# EAGLE design upduino_v2.1_release (EAGLE 8.6.3)

## Sheet 1 of 3
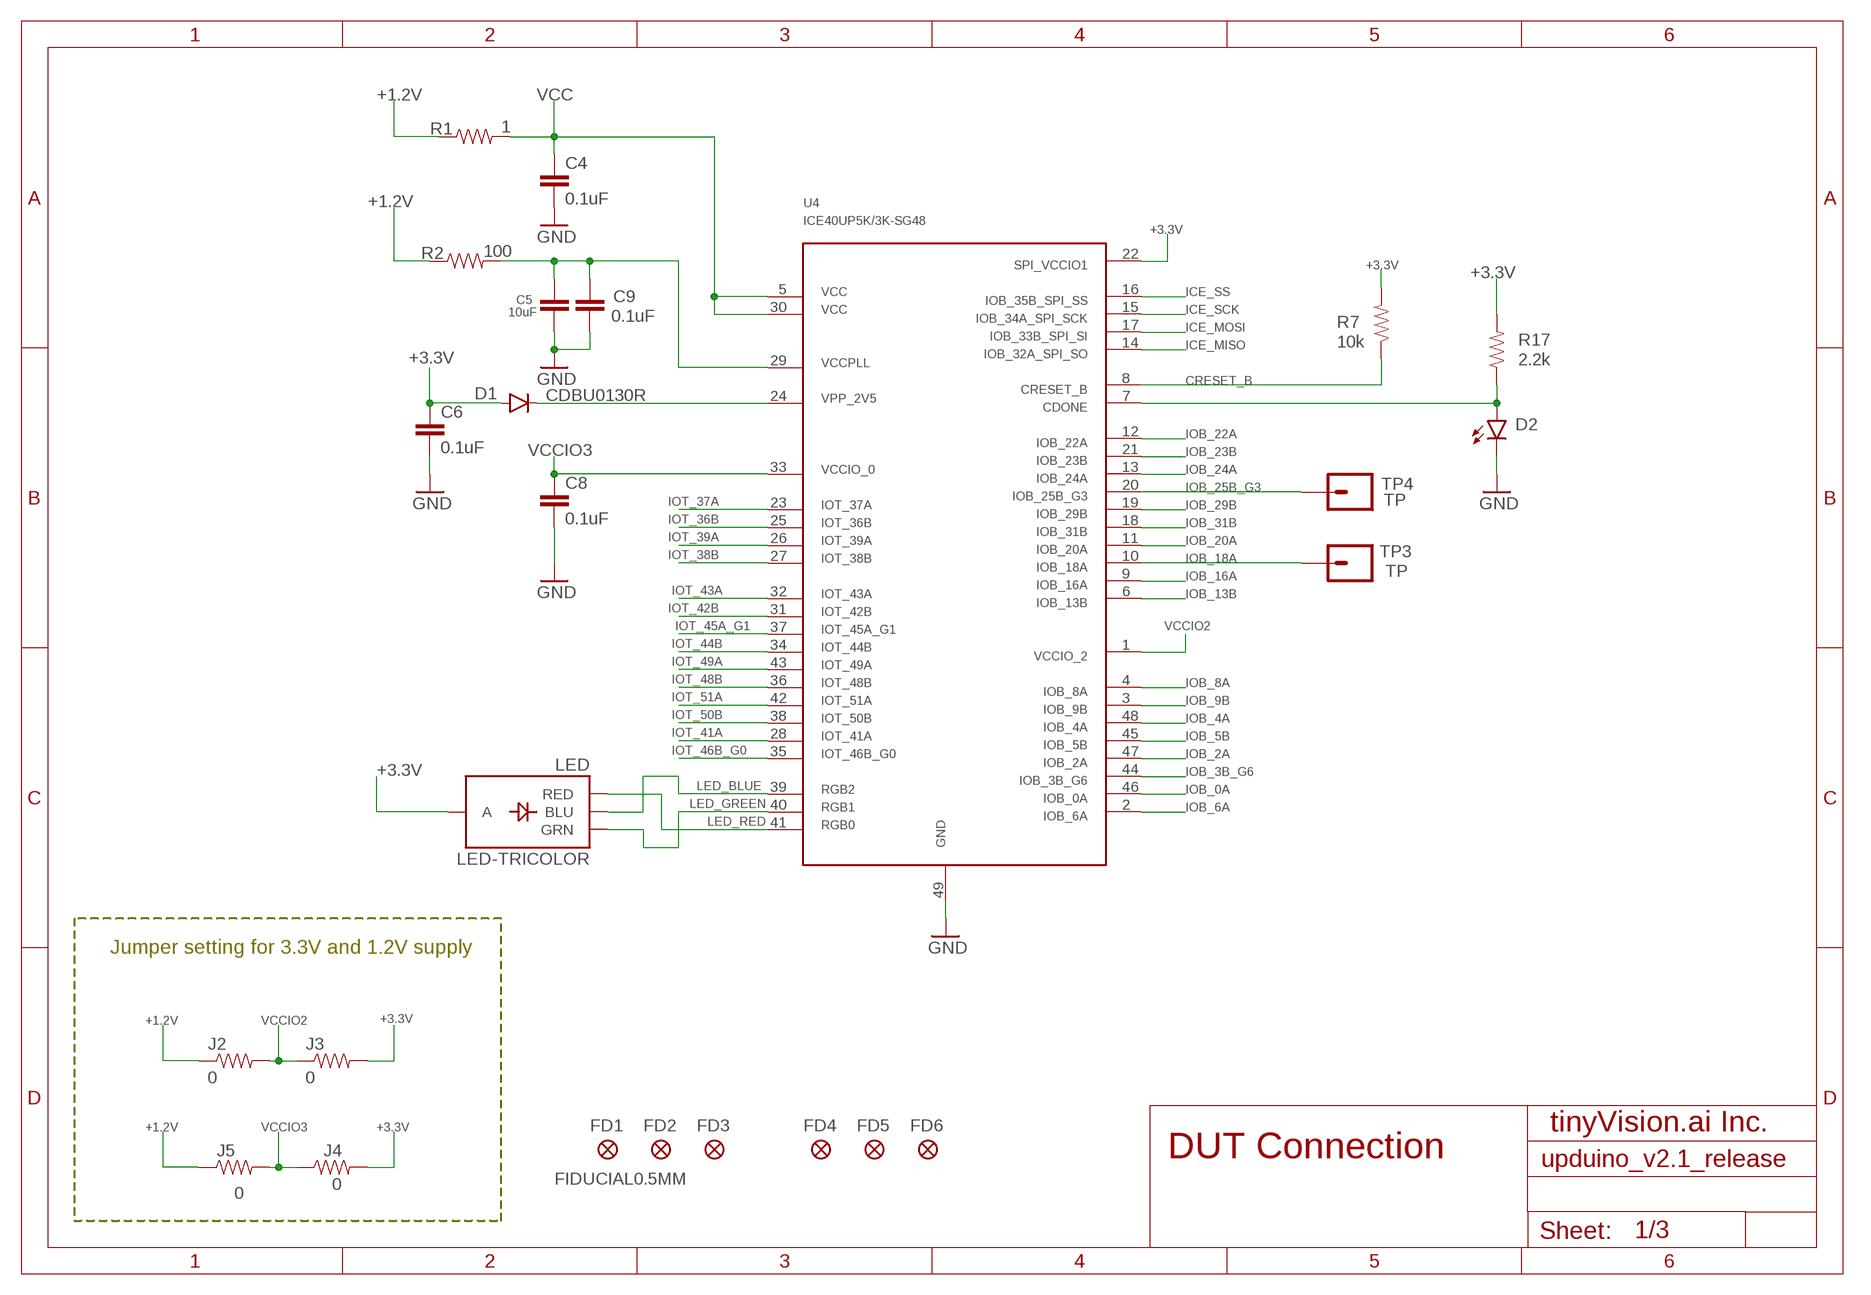
[diagram p0: schematic, sheet 1]

### Parts
C4  0.1uF  CAP0603-CAP  [0603-CAP]
C5  10uF  CAP0603-CAP  [0603-CAP]
C6  0.1uF  CAP0603-CAP  [0603-CAP]
C8  0.1uF  CAP0603-CAP  [0603-CAP]
C9  0.1uF  CAP0603-CAP  [0603-CAP]
D1  CDBU0130R  DIODE1  [SOD523]
D2  LED0603  [LED-0603]
FD1  FIDUCIAL0.5MM  [FIDUCIAL_0.5MM]
FD2  FIDUCIAL0.5MM  [FIDUCIAL_0.5MM]
FD3  FIDUCIAL0.5MM  [FIDUCIAL_0.5MM]
FD4  FIDUCIAL0.5MM  [FIDUCIAL_0.5MM]
FD5  FIDUCIAL0.5MM  [FIDUCIAL_0.5MM]
FD6  FIDUCIAL0.5MM  [FIDUCIAL_0.5MM]
J2  0  RESISTOR0603-RES  [0603-RES]
J3  0  RESISTOR0603-RES  [0603-RES]
J4  0  RESISTOR0603-RES  [0603-RES]
J5  0  RESISTOR0603-RES  [0603-RES]
LED  LED-TRICOLOR  [LED-TRICOLOR-SMD]
R1  1  RESISTOR0603-RES  [0603-RES]
R2  100  RESISTOR0603-RES  [0603-RES]
R7  10k  RESISTOR0603-RES  [0603-RES]
R17  2.2k  RESISTOR0603-RES  [0603-RES]
TP3  TP  [TP]
TP4  TP  [TP]
U4  ICE40UP5K/3K-SG48  [ICE40UP5K/3K-SG48]

### Nets
+1.2V: J2.1 J5.1 R1.1 R2.1 ; also sheet 2
+3.3V: C6.1 D1.A J3.2 J4.2 LED.A R7.2 R17.2 U4.22 ; also sheet 2
CRESET_B: R7.1 U4.8 ; also sheet 3
GND: C4.2 C5.2 C6.2 C8.2 C9.2 D2.C U4.49 ; also sheet 2,3
ICE_MISO: U4.14 ; also sheet 2
ICE_MOSI: U4.17 ; also sheet 2
ICE_SCK: U4.15 ; also sheet 2,3
ICE_SS: U4.16 ; also sheet 2,3
IOB_0A: U4.46 ; also sheet 2
IOB_2A: U4.47 ; also sheet 2
IOB_3B_G6: U4.44 ; also sheet 2
IOB_4A: U4.48 ; also sheet 2
IOB_5B: U4.45 ; also sheet 2
IOB_6A: U4.2 ; also sheet 2
IOB_8A: U4.4 ; also sheet 2
IOB_9B: U4.3 ; also sheet 2
IOB_13B: U4.6 ; also sheet 2
IOB_16A: U4.9 ; also sheet 2
IOB_18A: TP3.1 U4.10
IOB_20A: U4.11 ; also sheet 2
IOB_22A: U4.12 ; also sheet 2
IOB_23B: U4.21 ; also sheet 2
IOB_24A: U4.13 ; also sheet 2
IOB_25B_G3: TP4.1 U4.20
IOB_29B: U4.19 ; also sheet 2
IOB_31B: U4.18 ; also sheet 2
IOT_36B: U4.25 ; also sheet 2
IOT_37A: U4.23 ; also sheet 2
IOT_38B: U4.27 ; also sheet 2
IOT_39A: U4.26 ; also sheet 2
IOT_41A: U4.28 ; also sheet 2
IOT_42B: U4.31 ; also sheet 2
IOT_43A: U4.32 ; also sheet 2
IOT_44B: U4.34 ; also sheet 2
IOT_45A_G1: U4.37 ; also sheet 2
IOT_46B_G0: U4.35 ; also sheet 2
IOT_48B: U4.36 ; also sheet 2
IOT_49A: U4.43 ; also sheet 2
IOT_50B: U4.38 ; also sheet 2
IOT_51A: U4.42 ; also sheet 2
LED_BLUE: LED.B(BLU) U4.39
LED_GREEN: LED.G(GRN) U4.40
LED_RED: LED.R(RED) U4.41
N$1: C5.1 C9.1 R2.2 U4.29
N$3: D1.C U4.24
N$16: D2.A R17.1 U4.7
VCC: C4.1 R1.2 U4.5 U4.30
VCCIO2: J2.2 J3.1 U4.1
VCCIO3: C8.1 J4.1 J5.2 U4.33

### Notes on the sheet
- Jumper setting for 3.3V and 1.2V supply
- tinyVision.ai Inc.
- DUT Connection

## Sheet 2 of 3
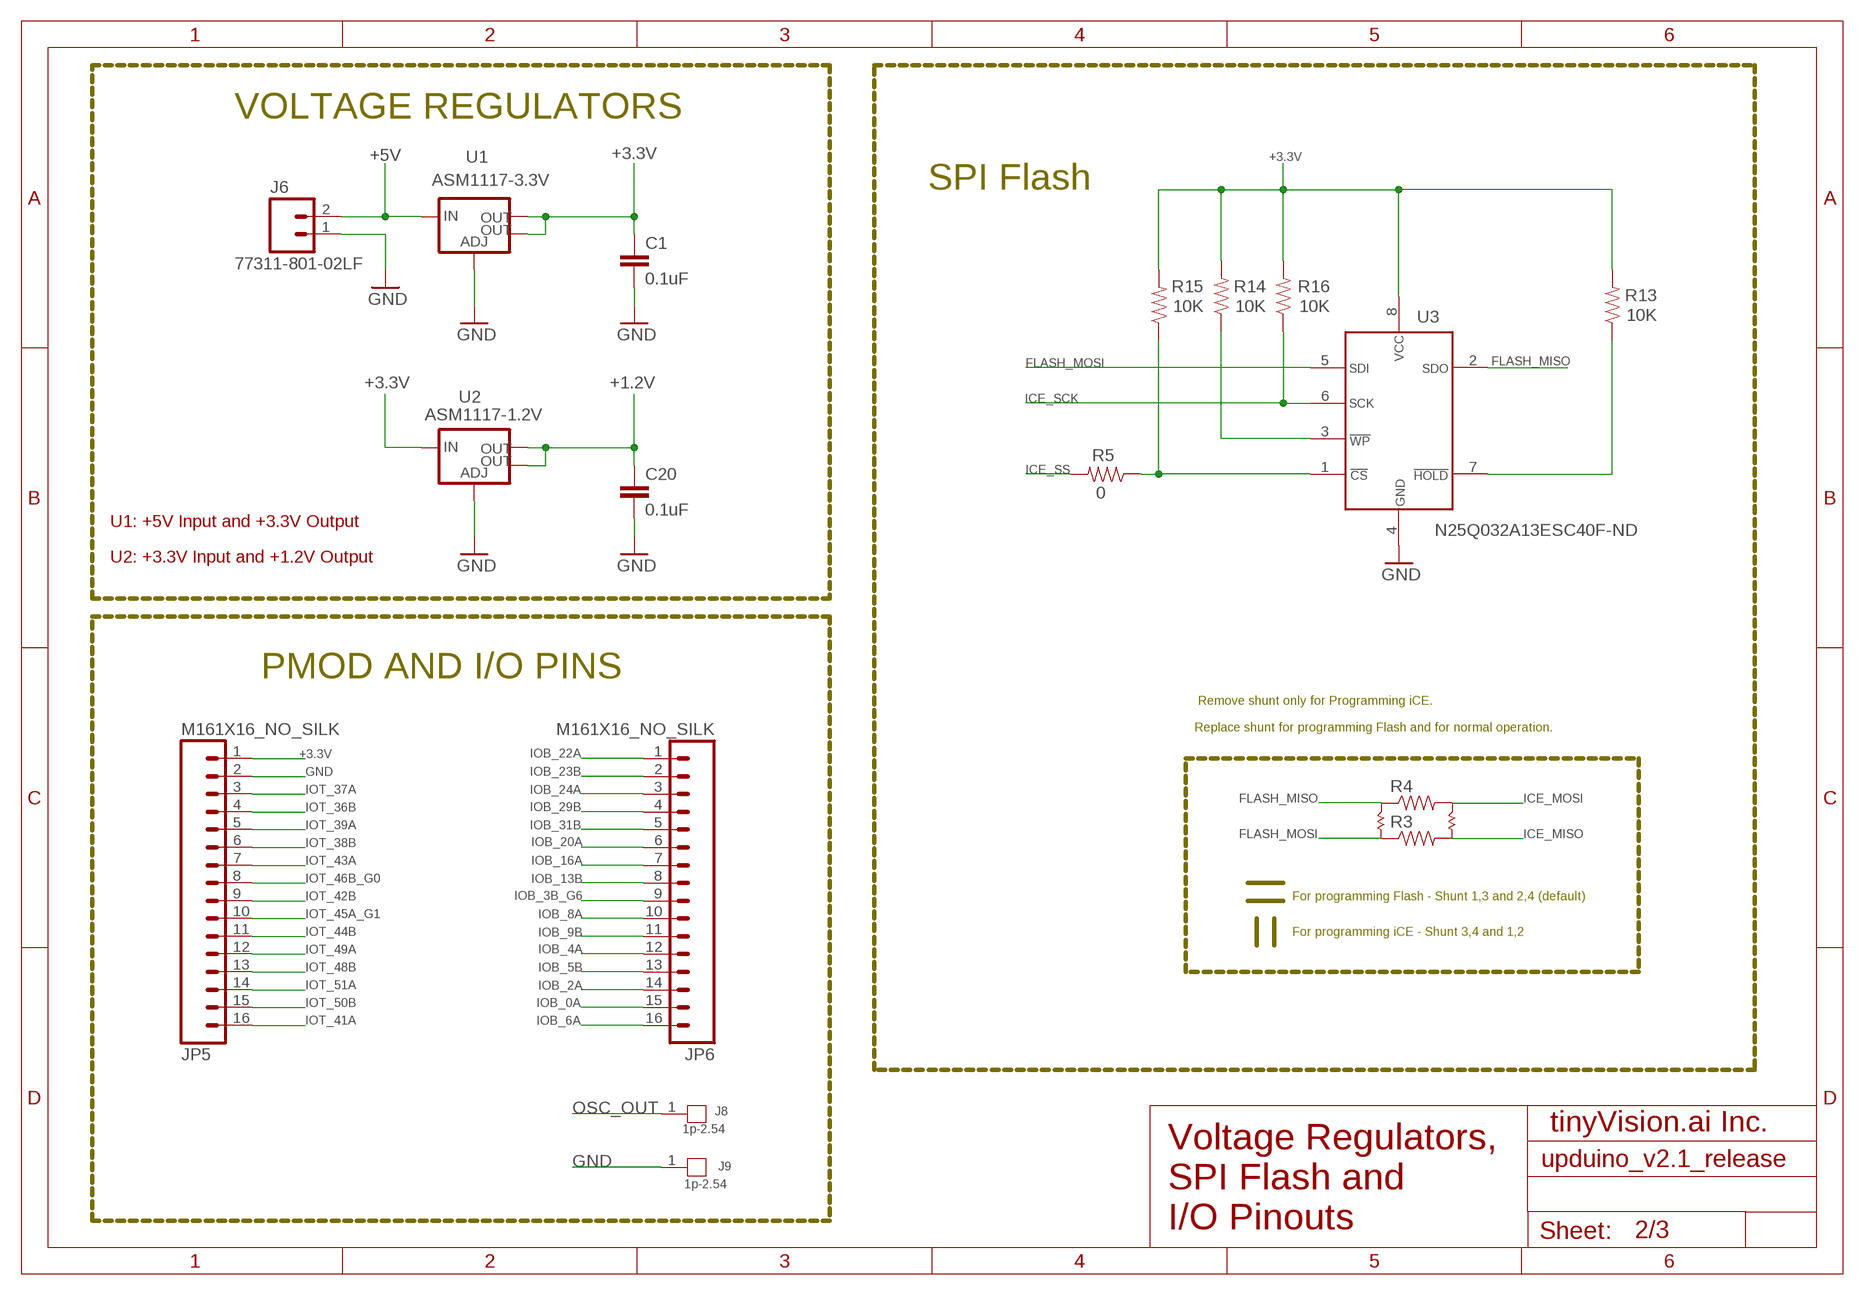
[diagram p1: schematic, sheet 2]

### Parts
C1  0.1uF  CAP0603-CAP  [0603-CAP]
C20  0.1uF  CAP0603-CAP  [0603-CAP]
J6  77311-801-02LF  M02PTH  [1X02]
J8  1p-2.54  DIP-BLACK-ROUND-FEMALE-HEADER-VERT(1P-2.54)  [1P-65/35MIL]
J9  1p-2.54  DIP-BLACK-ROUND-FEMALE-HEADER-VERT(1P-2.54)  [1P-65/35MIL]
JP5  M161X16_NO_SILK  [1X16_NO_SILK]
JP6  M161X16_NO_SILK  [1X16_NO_SILK]
R3  RESISTOR0603  [0603-RES]
R4  RESISTOR0603  [0603-RES]
R5  0  RESISTOR0603  [0603-RES]
R13  10K  RESISTOR0603-RES  [0603-RES]
R14  10K  RESISTOR0603-RES  [0603-RES]
R15  10K  RESISTOR0603-RES  [0603-RES]
R16  10K  RESISTOR0603-RES  [0603-RES]
U1  ASM1117-3.3V  V_REG_LM1117SOT223  [SOT223]
U2  ASM1117-1.2V  V_REG_LM1117SOT223  [SOT223]
U3  N25Q032A13ESC40F-ND  [SO8]

### Nets
+1.2V: C20.1 U2.2(OUT) U2.4(OUT) ; also sheet 1
+3.3V: C1.1 JP5.1 R13.2 R14.2 R15.2 R16.2 U1.2(OUT) U1.4(OUT) U2.3(IN) U3.8 ; also sheet 1
+5V: J6.2 U1.3(IN) ; also sheet 3
FLASH_MISO: R4.1 U3.2 ; also sheet 3
FLASH_MOSI: R3.1 U3.5 ; also sheet 3
GND: C1.2 C20.2 J6.1 J9.1 JP5.2 U1.1(ADJ) U2.1(ADJ) U3.4 ; also sheet 1,3
ICE_MISO: R3.2 ; also sheet 1
ICE_MOSI: R4.2 ; also sheet 1
ICE_SCK: R16.1 U3.6 ; also sheet 1,3
ICE_SS: R5.2 ; also sheet 1,3
IOB_0A: JP6.15 ; also sheet 1
IOB_2A: JP6.14 ; also sheet 1
IOB_3B_G6: JP6.9 ; also sheet 1
IOB_4A: JP6.12 ; also sheet 1
IOB_5B: JP6.13 ; also sheet 1
IOB_6A: JP6.16 ; also sheet 1
IOB_8A: JP6.10 ; also sheet 1
IOB_9B: JP6.11 ; also sheet 1
IOB_13B: JP6.8 ; also sheet 1
IOB_16A: JP6.7 ; also sheet 1
IOB_20A: JP6.6 ; also sheet 1
IOB_22A: JP6.1 ; also sheet 1
IOB_23B: JP6.2 ; also sheet 1
IOB_24A: JP6.3 ; also sheet 1
IOB_29B: JP6.4 ; also sheet 1
IOB_31B: JP6.5 ; also sheet 1
IOT_36B: JP5.4 ; also sheet 1
IOT_37A: JP5.3 ; also sheet 1
IOT_38B: JP5.6 ; also sheet 1
IOT_39A: JP5.5 ; also sheet 1
IOT_41A: JP5.16 ; also sheet 1
IOT_42B: JP5.9 ; also sheet 1
IOT_43A: JP5.7 ; also sheet 1
IOT_44B: JP5.11 ; also sheet 1
IOT_45A_G1: JP5.10 ; also sheet 1
IOT_46B_G0: JP5.8 ; also sheet 1
IOT_48B: JP5.13 ; also sheet 1
IOT_49A: JP5.12 ; also sheet 1
IOT_50B: JP5.15 ; also sheet 1
IOT_51A: JP5.14 ; also sheet 1
N$4: R13.1 U3.7
N$6: R14.1 U3.3
N$7: R5.1 R15.1 U3.1
OSC_OUT: J8.1 ; also sheet 3

### Notes on the sheet
- VOLTAGE REGULATORS
- SPI Flash
- U3
- U1: +5V Input and +3.3V Output
- U2: +3.3V Input and +1.2V Output
- PMOD AND I/O PINS
- Remove shunt only for Programming iCE.
- Replace shunt for programming Flash and for normal operation.
- For programming Flash - Shunt 1,3 and 2,4 (default)
- For programming iCE - Shunt 3,4 and 1,2
- tinyVision.ai Inc.
- Voltage Regulators, 
  SPI Flash and 
  I/O Pinouts

## Sheet 3 of 3
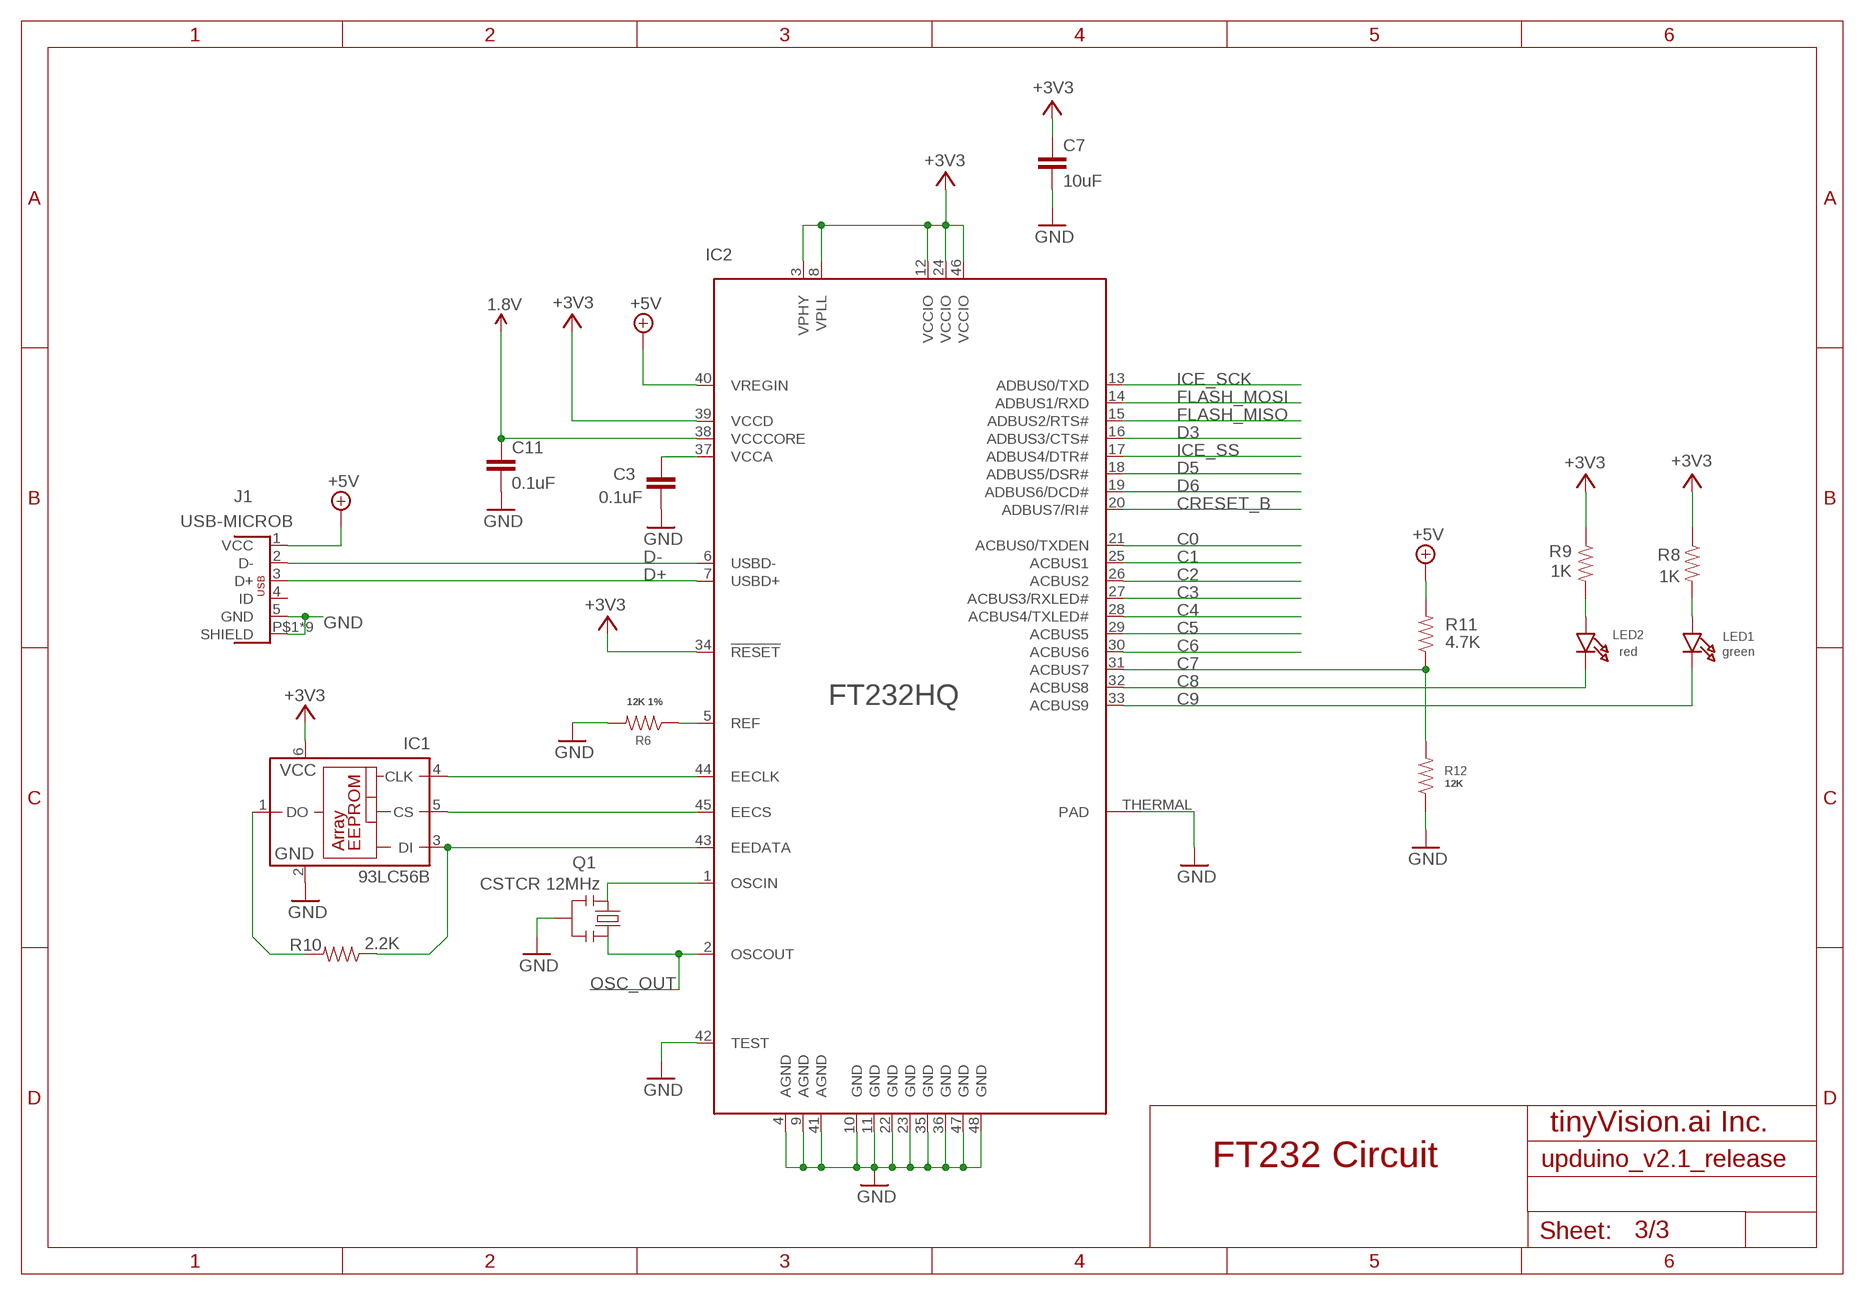
[diagram p2: schematic, sheet 3]

### Parts
C3  0.1uF  CAP0603-CAP  [0603-CAP]
C7  10uF  CAP0603-CAP  [0603-CAP]
C11  0.1uF  CAP0603-CAP  [0603-CAP]
IC1  93LC56B  93LC76A  [SOT23-6]
IC2  FT232HQ  [QFN48_8MM]
J1  USB-MICROB  [USB_MICROB_10118194-0001LF]
LED1  green  LED0805_NOOUTLINE  [CHIPLED_0805_NOOUTLINE]
LED2  red  LED0805_NOOUTLINE  [CHIPLED_0805_NOOUTLINE]
Q1  CSTCR 12MHz  RESONATORSMD  [RESONATOR-SMD]
R6  12K 1%  RESISTOR0603  [0603-RES]
R8  1K  RESISTOR0603  [0603-RES]
R9  1K  RESISTOR0603  [0603-RES]
R10  2.2K  RESISTOR0603  [0603-RES]
R11  4.7K  RESISTOR0603  [0603-RES]
R12  12K  RESISTOR0603  [0603-RES]

### Nets
1.8V: C11.1 IC2.38(VCCCORE)
+3V3: C7.1 IC1.6(VCC) IC2.3(VPHY) IC2.8(VPLL) IC2.12(VCCIO) IC2.24(VCCIO) IC2.34(!RESET) IC2.39(VCCD) IC2.46(VCCIO) R8.1 R9.1
+5V: IC2.40(VREGIN) J1.1(VCC) R11.2 ; also sheet 2
C0: IC2.21(ACBUS0/TXDEN)
C1: IC2.25(ACBUS1)
C2: IC2.26(ACBUS2)
C3: IC2.27(ACBUS3/RXLED#)
C4: IC2.28(ACBUS4/TXLED#)
C5: IC2.29(ACBUS5)
C6: IC2.30(ACBUS6)
C7: IC2.31(ACBUS7) R11.1 R12.2
C8: IC2.32(ACBUS8) LED2.C
C9: IC2.33(ACBUS9) LED1.C
CRESET_B: IC2.20(ADBUS7/RI#) ; also sheet 1
D3: IC2.16(ADBUS3/CTS#)
D5: IC2.18(ADBUS5/DSR#)
D6: IC2.19(ADBUS6/DCD#)
D+: IC2.7(USBD+) J1.3(D+)
D-: IC2.6(USBD-) J1.2(D-)
FLASH_MISO: IC2.15(ADBUS2/RTS#) ; also sheet 2
FLASH_MOSI: IC2.14(ADBUS1/RXD) ; also sheet 2
GND: C3.2 C7.2 C11.2 IC1.2(GND) IC2.4(AGND) IC2.9(AGND) IC2.10(GND) IC2.11(GND) IC2.22(GND) IC2.23(GND) IC2.35(GND) IC2.36(GND) IC2.41(AGND) IC2.42(TEST) IC2.47(GND) IC2.48(GND) IC2.THERMAL(PAD) J1.5(GND) J1.P$1(SHIELD) J1.P$2(SHIELD) J1.P$3(SHIELD) J1.P$4(SHIELD) J1.P$5(SHIELD) J1.P@1(SHIELD) J1.P@2(SHIELD) J1.P@3(SHIELD) J1.P@4(SHIELD) Q1.2 R6.2 R12.1 ; also sheet 1,2
ICE_SCK: IC2.13(ADBUS0/TXD) ; also sheet 1,2
ICE_SS: IC2.17(ADBUS4/DTR#) ; also sheet 1,2
N$2: IC2.1(OSCIN) Q1.1
N$9: IC2.5(REF) R6.1
N$10: LED2.A R9.2
N$11: LED1.A R8.2
N$12: IC1.3(DI) IC2.43(EEDATA) R10.1
N$13: IC1.5(CS) IC2.45(EECS)
N$14: IC1.4(CLK) IC2.44(EECLK)
N$15: IC1.1(DO) R10.2
OSC_OUT: IC2.2(OSCOUT) Q1.3 ; also sheet 2
VCCA: C3.1 IC2.37(VCCA)
Unconnected: J1.4(ID)

### Notes on the sheet
- tinyVision.ai Inc.
- FT232 Circuit

## Library data of the parts
C1 C3-C9 C11 C20 = gtjennings_pcb_121217_1200_release:CAP: Capacitor Standard 0603 ceramic capacitor, and 0.1" leaded capacitor.
D1 = CDBU0130R:DIODE1
D2 = SparkFun-LED:LED: LED (Generic) Standard schematic elements and footprints for 5mm, 3mm, 1206, and 0603 sized LEDs. Generic LEDs with no color specified.
FD1-FD6 = VS_Misc:FIDUCIAL0.5MM
IC1 = microchip:93*76?: 8K Microwire Compatible Serial EEPROM Source: http://ww1.microchip.com/downloads/en/DeviceDoc/21796H.pdf; MF: MICROCHIP; MPN: 93LC76AT-I/OT; OC_FARNELL: 1556170; OC_NEWARK: 61H6824
IC2 = gtjennings_pcb_121217_1200_release:FT232H
J1 = VS_Connectors:USB-MICROB: CONN RCPT STD MICRO USB TYPE AB
J2-J5 R1 R2 R7 R13-R17 = SparkFun-Resistors:RESISTOR: Resistor Basic schematic elements and footprints for 0603, 1206, and PTH resistors.
J6 = SparkFun-Connectors:M02: Standard 2-pin 0.1" header. Use with - straight break away headers ( PRT-00116) - right angle break away headers (PRT-00553) - swiss pins (PRT-00743) - machine pins (PRT-00117) - female headers (PRT-00115) Molex polarized connector foot print use with: PRT-08233 with associated crimp pins and housings. 2.54_SCREWTERM for use with PRT-10571. 3.5mm Screw Terminal footprints for PRT-08084 5mm Screw Terminal footprints for use with PRT-08432
J8 J9 = Seeed-OPL-Connector:DIP-BLACK-ROUND-FEMALE-HEADER-VERT(1P-2.54): 320030026; MPN: RF130-1013BBS0741
JP5 JP6 = SparkFun-Connectors:M16: 1x16 .1" header
LED = SparkFun-LED:LED-TRICOLOR: Tri-Color LED SMD Proven layout and schematic for triple color LED in SMD package - common anode. Spark Fun Electronics SKU : COM-07844
LED1 LED2 = microbuilder:LED: LED 0603 - 0603 Surface Mount Package 2mA: Green LED - Low Power (3.9mcd, 2ma, 1.7Vf) - Digikey: 475-2709-2-ND Orange LED - Low Power (9.8mcd, 2ma, 1.8Vf) - Digikey: 475-1194-2-ND Red LED - Low Power (5mcd, 2ma, 1.8Vf) - Digikey: 475-1195-2-ND Yellow LED - Low Power (7mcd, 2ma, 1.8Vf) - Digikey: 475-1196-2-ND 5mA: Blue LED - Low Power (17mcd, 5ma, 2.9Vf) - Digikey: LNJ937W8CRACT-ND 0805 - 0805 Surface Mount Package 2mA: Red LED (8.8mcd, 2mA, 1.8Vf, Clear) - Low Power [Digikey: 475-2510-1-ND] Green LED (5mcd, 2mA, 1.8Vf, Clear) - Low Power [Digikey: 475-2730-1-ND] Yellow LED (11.3mcd, 2mA, 1.8Vf, Clear) - Low Power [Digikey: 475-2555-1-ND] 20mA: Red LED (104mcd, 20mA, Diffused) - LS R976 [Digikey: 475-1278-6-ND] Red LED (12mcd, 20mA, 2.0Vf, Clear) - APT2012EC [Digikey: 754-1128-1-ND] Green LED (15mcd, 20mA, 2.2Vf, Clear) - APT2012GC [Digikey: 754-1131-1-ND] Orange LED (160mcd, 20mA, 2.1Vf, Clear) - APT2012SECK [Digikey: 754-1130-1-ND] 1206 - 1206 Surface Mount Package Green LED (26mcd, 20mA, Diffused) - LG N971 [Digikey: 475-1407-6-ND] Red LED (15mcd, 20mA, Diffused) - LH N974 [Digikey: 475-1416-6-ND] Cree - Cree High-Power Surface Mount LEDs XPEBWT-L1-0000-00D50 - White 111lm 350mA 2.9Vf 6200K 110° XTEAWT-00-0000-00000LEE3 - White 114lm 350mA 2.85Vf 5000K 115° Everlight - Everlight 45-21 Series Surface Mount LEDs 45-21/QK2C-B2832AC2CB2/2T - Warm White 2000mcd 20mA 3.25Vf 3050K 120° 45-21/LK2C-B38452C4CB2/2T - Nuetral White 2000mcd 20mA 3.25Vf 4150K 120° 45-21/LK2C-B50634C6CB2/2T - Cold White 2200mcd 20mA 3.25Vf 5650K 120° PLCC2 Reverse Mount LS T77K-J1L2-1-0-2-R18-Z - Red 11.25mcd 2mA 1.8Vf 630nm 120° LO T77K-L1M2-24-Z - Orange 19.6mcd 2mA 1.8Vf 606nm 120° LY T77K-K2M1-26-Z - Yellow 15.7mcd 2mA 1.8Vf 587nm 120°
Q1 = SparkFun:RESONATOR: Resonator Small SMD resonator. This is the itty bitty 10/20MHz resonators with built in caps. CSTCE10M0G55 and CSTCE20M0V53. Footprint has been reviewed closely but hasn't been tested yet.
R3-R6 R8-R12 = gtjennings_pcb_121217_1200_release:RESISTOR: Resistor Basic schematic elements and footprints for 0603, 1206, and PTH resistors.
TP3 TP4 = TP1:TP
U1 U2 = SparkFun-PowerIC:V_REG_LM1117: Voltage Regulator LM1117 Standard adjustable voltage regulator but in SMD form. Spark Fun Electronics SKU : COM-00595; PROD_ID: VREG-08170
U3 = gtjennings_pcb_121217_1200_release:N25Q032A13ESC40F-ND; MPN: N25Q032A13ESC40F-ND
U4 = ICE40UP5K-3K-SG48:ICE40UP5K/3K-SG48

## Net classes
1 vcc: width 0.152 mm

## Board
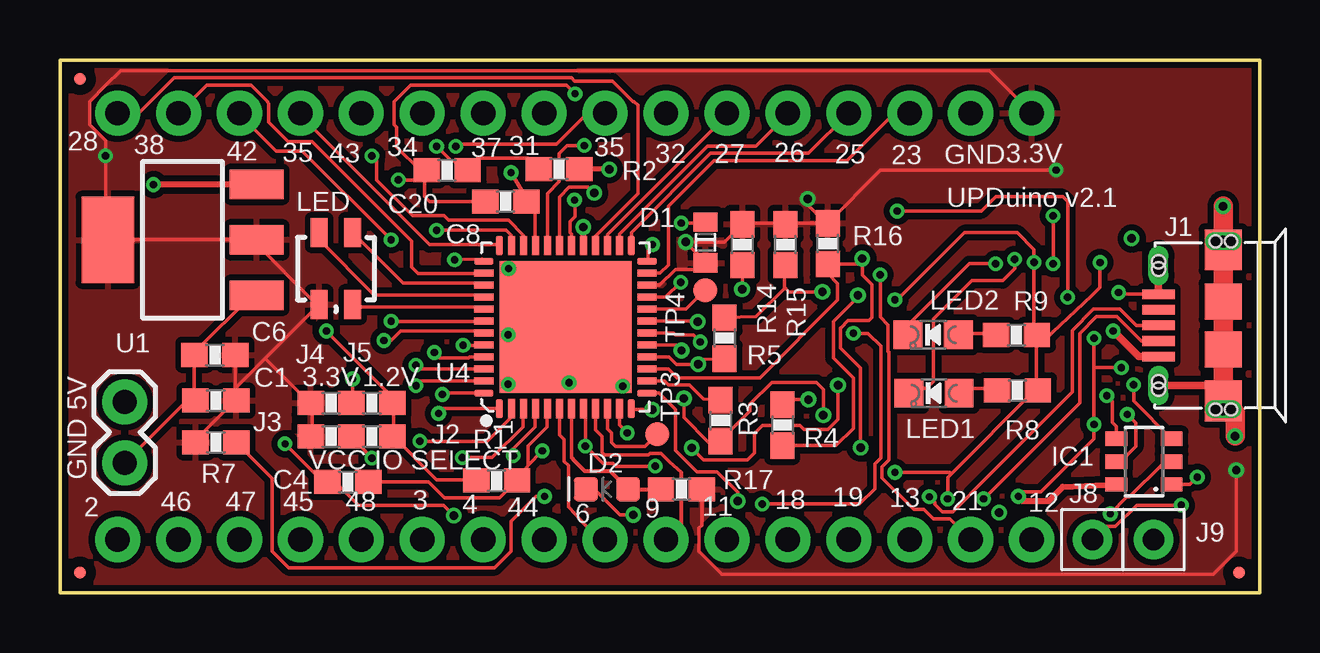
[diagram p3: board, top side]
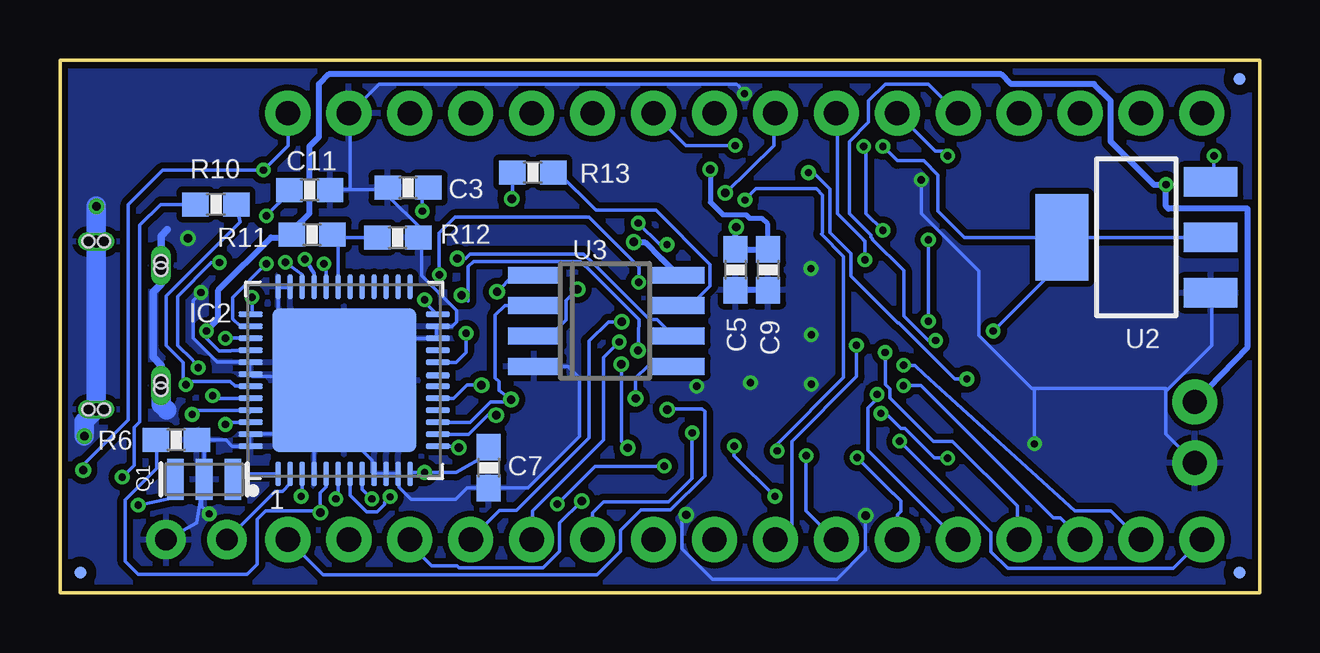
[diagram p4: board, bottom side, seen from below]

Size 50 x 22.22 mm. Coordinates in mm from the lower left corner, seen from the top.
Outline: 50,0 50,22.22 0,22.22 0,0 50,0
Copper layers (1*16): Top 0.035mm / dielectric 1.5mm / Bottom 0.035mm
Design rules "default *": minimum track width 6mil, minimum drill 0.3mm, track to track 6mil, track to pad 6mil, pad to pad 6mil, via to via 6mil, smd to smd 0mil, copper to edge 10mil, drill to drill 10mil, minimum pad ring 5mil, minimum via ring 6mil, stop-mask expansion 2mil, vias tented up to drill 100mil, thermal gap 10mil

### Footprints (pad centres in the part's own frame; a part is rotated, then mirrored left to right if it is on the bottom)
0603-CAP = smd 1.1 x 1: 1 -0.85,0; 2 0.85,0
SOD523 = smd 0.8 x 1: A 1.1,0; C -0.6,0
LED-0603 = smd 1 x 1: A -0.877,0; C 0.877,0
FIDUCIAL_0.5MM = smd 0.508 x 0.508: 1 0,0
SOT23-6 = smd 0.6 x 0.9: 1 -0.95,-1.15; 2 0,-1.15; 3 0.95,-1.15; 4 0.95,1.15; 5 0,1.15; 6 -0.95,1.15
QFN48_8MM = smd 1 x 0.23: 1 -3.9,2.75; 2 -3.9,2.25; 3 -3.9,1.75; 4 -3.9,1.25; 5 -3.9,0.75; 6 -3.9,0.25; 7 -3.9,-0.25; 8 -3.9,-0.75; 9 -3.9,-1.25; 10 -3.9,-1.75; 11 -3.9,-2.25; 12 -3.9,-2.75; 25 3.9,-2.75; 26 3.9,-2.25; 27 3.9,-1.75; 28 3.9,-1.25; 29 3.9,-0.75; 30 3.9,-0.25; 31 3.9,0.25; 32 3.9,0.75; 33 3.9,1.25; 34 3.9,1.75; 35 3.9,2.25; 36 3.9,2.75 | smd 0.23 x 1: 13 -2.75,-3.9; 14 -2.25,-3.9; 15 -1.75,-3.9; 16 -1.25,-3.9; 17 -0.75,-3.9; 18 -0.25,-3.9; 19 0.2,-3.9; 20 0.75,-3.9; 21 1.25,-3.9; 22 1.75,-3.9; 23 2.25,-3.9; 24 2.75,-3.9; 37 2.75,3.9; 38 2.25,3.9; 39 1.75,3.9; 40 1.25,3.9; 41 0.75,3.9; 42 0.25,3.9; 43 -0.25,3.9; 44 -0.75,3.9; 45 -1.25,3.9; 46 -1.75,3.9; 47 -2.25,3.9; 48 -2.75,3.9 | smd 6 x 6: THERMAL 0,0
USB_MICROB_10118194-0001LF = smd 0.4 x 1.35: 1 -1.3,2.7; 2 -0.65,2.7; 3 0,2.7; 4 0.65,2.7; 5 1.3,2.7 | drill 0.275 pad 0.475 long: P$1 -2.5,2.7 | drill 0.55 pad 0.75 long: P$2 2.5,2.7; P$5 -2.5,2.7 | drill 0.5 pad 0.75 long: P$3 -3.5,0; P$4 3.5,0 | smd 1.7 x 1.55: P@1 -3.15,0; P@4 3.15,0 | smd 1.5 x 1.55: P@2 -1,0; P@3 1,0 | hole 0.5: -3.504,0.325; -3.503,-0.324; 3.5,0.325; 3.5,-0.327 | hole 0.55: -2.651,2.702; -2.347,2.698; 2.353,2.698; 2.653,2.698
0603-RES = smd 1.1 x 1: 1 -0.85,0; 2 0.85,0
1X02 = drill 1.016 pad 1.88: 1 0,0; 2 2.54,0
1P-65/35MIL = drill 0.889 pad 1.651: 1 0,0
1X16_NO_SILK = drill 1.016 pad 1.88: 1 0,0; 2 2.54,0; 3 5.08,0; 4 7.62,0; 5 10.16,0; 6 12.7,0; 7 15.24,0; 8 17.78,0; 9 20.32,0; 10 22.86,0; 11 25.4,0; 12 27.94,0; 13 30.48,0; 14 33.02,0; 15 35.56,0; 16 38.1,0
LED-TRICOLOR-SMD = smd 0.7 x 1.2: A -0.7,-1.5; B 0.7,1.5; G -0.7,1.5; R 0.7,-1.5
CHIPLED_0805_NOOUTLINE = smd 1.2 x 1.2: A 0,-1.05; C 0,1.05
RESONATOR-SMD = smd 0.7 x 1.7: 1 -1.2,0; 2 0,0; 3 1.2,0
TP = smd 1 x 1: 1 0,0
SOT223 = smd 1.219 x 2.235: 1 -2.311,-3.099; 2 0,-3.099; 3 2.311,-3.099 | smd 3.6 x 2.2: 4 0,3.099
SO8 = smd 0.7 x 2.2: 1 -1.905,-2.8; 2 -0.635,-2.8; 3 0.635,-2.8; 4 1.905,-2.8; 5 1.905,3.2; 6 0.635,3.2; 7 -0.635,3.2; 8 -1.905,3.2
ICE40UP5K/3K-SG48 = smd 0.8 x 0.3: 1 -3.4,2.75; 2 -3.4,2.25; 3 -3.4,1.75; 4 -3.4,1.25; 5 -3.4,0.75; 6 -3.4,0.25; 7 -3.4,-0.25; 8 -3.4,-0.75; 9 -3.4,-1.25; 10 -3.4,-1.75; 11 -3.4,-2.25; 12 -3.4,-2.75; 25 3.4,-2.75; 26 3.4,-2.25; 27 3.4,-1.75; 28 3.4,-1.25; 29 3.4,-0.75; 30 3.4,-0.25; 31 3.4,0.25; 32 3.4,0.75; 33 3.4,1.25; 34 3.4,1.75; 35 3.4,2.25; 36 3.4,2.75 | smd 0.3 x 0.8: 13 -2.75,-3.4; 14 -2.25,-3.4; 15 -1.75,-3.4; 16 -1.25,-3.4; 17 -0.75,-3.4; 18 -0.25,-3.4; 19 0.25,-3.4; 20 0.75,-3.4; 21 1.25,-3.4; 22 1.75,-3.4; 23 2.25,-3.4; 24 2.75,-3.4; 37 2.75,3.4; 38 2.25,3.4; 39 1.75,3.4; 40 1.25,3.4; 41 0.75,3.4; 42 0.25,3.4; 43 -0.25,3.4; 44 -0.75,3.4; 45 -1.25,3.4; 46 -1.75,3.4; 47 -2.25,3.4; 48 -2.75,3.4 | smd 5.5 x 5.5: 49 0,0

### Placement (x,y rotation side)
C1  6.5,8.02 180 top
C3  35.49,16.89 180 bottom
C4  12,4.62 180 top
C5  21.84,13.47 270 bottom
C6  6.46,9.92 180 top
C7  32.13,5.22 270 bottom
C8  18.58,16.32 180 top
C9  20.48,13.47 270 bottom
C11  39.59,16.8 0 bottom
C20  16.14,17.62 180 top
D1  26.9,14.86 270 top
D2  22.8,4.32 180 top
FD1  0.84,0.84 0 top
FD2  0.84,0.84 0 bottom
FD3  49.14,0.84 0 top
FD4  49.14,0.84 0 bottom
FD5  0.84,21.42 0 top
FD6  0.84,21.42 0 bottom
IC1  45.18,5.47 90 top
IC2  38.15,8.86 90 bottom
J1  48.49,11.15 90 top
J2  13,6.52 180 top
J3  11.3,6.52 180 top
J4  11.3,7.92 180 top
J5  13,7.92 180 top
J6  2.7,5.42 90 top
J8  43.04,2.22 0 top
J9  45.58,2.22 0 top
JP5  40.5,20 180 top
JP6  40.5,2.22 180 top
LED  11.5,13.52 0 top
LED1  36.43,8.32 90 top
LED2  36.4,10.76 90 top
Q1  43.99,4.73 180 bottom
R1  18.2,4.68 0 top
R2  20.8,17.66 0 top
R3  27.54,7.18 90 top
R4  30.11,6.99 270 top
R5  27.7,10.62 270 top
R6  45.15,6.37 0 bottom
R7  6.5,6.28 180 top
R8  39.91,8.45 180 top
R9  39.87,10.75 180 top
R10  43.5,16.2 180 bottom
R11  39.49,14.94 180 bottom
R12  35.92,14.81 180 bottom
R13  30.29,17.53 180 bottom
R14  28.44,14.52 90 top
R15  30.24,14.52 90 top
R16  32,14.56 90 top
R17  25.9,4.32 0 top
TP3  24.9,6.62 0 top
TP4  26.9,12.62 0 top
U1  5.1,14.72 90 top
U2  5.14,14.82 90 bottom
U3  27.43,11.34 270 bottom
U4  21.07,11.08 90 top

### Tracks (layer width: path | path; a pad name or v marks a point on that pad's centre or on a via)
1.8V  (via drill 0.3)
  Top 0.152: v41.4,13.72 v41.4,15.72
  Bottom 0.152: v41.4,15.72 40.4,16.72 C11.1 | v41.4,13.72 42.8,12.32 42.8,11.42 42.5,11.12 42.1,11.12 IC2.38
+1.2V  (via drill 0.3)
  Top 0.152: 13.9,6.52 13.9,7.92 J5.1 13.8,7.92 13.8,8.22 v11.1,10.92 | 13.9,6.52 15.7,4.72 17.3,4.72 R1.1 | 13.9,6.52 J2.1 | v15.7,18.62 16.3,18.02 16.4,18.02 16.8,17.62 16.9,17.62 | 16.9,17.62 17.4,18.12 19.5,18.12 R2.1 | 16.9,17.62 C20.1
  Bottom 0.152: U2.4 7.2,14.82 | 7.2,14.82 U2.2 | 7.2,14.82 v11.1,10.92 | 8.1,14.82 U2.4 | U2.4 12.3,14.82 13.4,15.92 13.4,17.42 14,18.02 15.1,18.02 v15.7,18.62
+3.3V  (via drill 0.3, 0.35)
  Top 0.152: J3.2 10.5,6.52 10.5,7.92 J4.2 10.4,7.92 8.55,9.77 | 7.3,8.02 5.8,6.52 5.8,6.12 R7.2 | 7.3,8.02 7.3,8.52 | 7.3,8.52 C6.1 | 7.3,8.02 C1.1 | 7.3,8.52 8.55,9.77 | 8.55,9.77 LED.A 10.7,12.02 8,14.72 U1.2 U1.4 1.9,14.72 v1.9,18.22 1.9,18.85 1.23,19.52 1.23,20.48 1.92,21.17 2.53,21.78 38.19,21.78 38.2,21.77 38.73,21.77 JP5.1 | 31.91,15.42 30.3,15.42 R15.2 30.2,15.42 28.5,15.42 R14.2 27.7,14.63 v26.08,14.63 26.9,13.81 D1.A 26.9,13.72 26.66,13.48 25.65,13.48 25,12.83 U4.22 | 31.91,15.42 R16.2 | v41.52,17.63 34.2,17.62 R16.2 | R16.2 | v31.17,16.43 31.17,16.16 31.91,15.42 | R17.2 26.75,2.82 26.63,2.7 26.63,1.74 27.32,1.05 27.59,0.78 48.07,0.78 49.03,1.74 v49.03,5.12
  Bottom 0.152: v1.9,18.22 1.9,17.22 U2.3 | 26.05,14.6 v26.08,14.63 | R13.2 31.14,16.46 v31.17,16.43 | v49.03,5.12 49.03,5.33 47.15,7.21 47.15,16.18 45.71,17.62 v41.53,17.62 v41.52,17.63 40.5,18.65 JP5.1
  Bottom 0.254: U3.8 24.92,13.94 24.94,13.94 25.6,14.6 26.05,14.6
  pour Top (isolate 0.254): 0.04,22.27 50,22.27 50,0.31 0,0.31 0,22.22
+3V3  (via drill 0.3)
  Top 0.152: 43.1,9.38 v43.1,7.02 43.1,6.42 40.88,4.21 40.13,4.21 v39.95,4.02 | 43.1,9.38 v43.1,10.62 | 40.7,10.22 40.7,10.72 R9.1 40.6,10.82 v40.6,13.78 40.6,14.32 39.9,15.02 37.7,15.02 34.9,12.22 v34.8,12.22 | 40.7,10.22 40.7,8.52 R8.1 40.6,8.42 37.15,4.97 | v37,3.92 37,4.82 37.15,4.97 | v34.8,5.02 37.1,5.02 37.15,4.97 | 40.7,10.22 43,12.39 43.35,12.74 v43.35,13.77 | v44.24,9.39 43.11,9.39 43.1,9.38
  Top 0.254: IC1.6 41.8,4.42 41.2,3.82 40.1,3.82 v39.95,4.02
  Bottom 0.152: v43.1,10.62 42.1,10.62 IC2.39 | IC2.12 35.4,5.02 v34.8,5.02 33.5,5.02 32.1,5.82 C7.1 | v37,3.92 37.4,4.32 37.4,4.92 IC2.8 | v34.8,12.22 34.8,12.12 34.3,11.62 IC2.24 | v40.6,13.78 39.9,13.28 39.9,12.82 IC2.34 | v44.24,9.39 44.5,9.72 45.1,10.32 45.1,12.36 43.69,13.77 v43.35,13.77 | v39.95,4.02 39.9,4.07 IC2.3 | IC2.46 43.01,7.11 v43.1,7.02
+5V  (via drill 0.3)
  Top 0.152: 7.9,17.02 U1.3
  Top 0.254: v43.9,10.92 43.8,11.02 | 7.9,17.02 v3.9,17.02
  Top 0.305: v43.9,10.92 44.97,9.85 J1.1
  Bottom 0.152: v43.9,10.92 43.9,10.62 43.37,10.09 42.88,10.09 42.85,10.11 IC2.40
  Bottom 0.254: v43.9,10.92 43.4,11.42 43.4,12.62 41.2,14.82 40.26,14.82 R11.2 40.24,15.18 39.6,15.82 39.6,18.62 39.2,19.02 39.2,21.22 38.8,21.62 10.76,21.62 10.36,21.22 6.9,21.22 6.2,20.52 6.2,18.82 4.4,17.02 v3.9,17.02 3.9,16.12 3.8,16.02 0.5,16.02 0.5,10.26 J6.2
C7
  Bottom 0.152: IC2.31 38.4,14.71 R11.1 38.51,14.81 R12.2
C8  (via drill 0.3)
  Top 0.152: v39,13.72 37.9,13.72 35.3,11.12 LED2.C
  Bottom 0.152: IC2.32 38.9,13.62 v39,13.72
C9  (via drill 0.3)
  Top 0.152: v39.79,13.91 39.8,13.52 39.3,13.02 38,13.02 36.4,11.42 36.4,8.82 36.1,8.52 35.3,8.52 35.3,8.44 LED1.C
  Bottom 0.152: IC2.33 39.4,13.32 v39.79,13.91
CRESET_B  (via drill 0.3)
  Top 0.152: U4.8 21.9,7.62 v21.9,6.12 22.63,5.39 23.05,5.39 23.17,5.28 v24.81,5.28 | R7.1 8.85,4.78 8.85,1.74 9.54,1.05 18.12,1.05 18.81,1.74 18.81,2.99 19.84,4.02 v20.2,4.02 | v29.27,3.7 33.33,3.7 33.96,4.33 33.96,5.37 34.22,5.63 34.22,10.28 33.68,10.82 v33.07,10.82
  Bottom 0.152: v20.2,4.02 21.9,5.72 v21.9,6.12 | IC2.20 33.49,9.61 33.07,10.03 v33.07,10.82 | v29.27,3.7 27.69,5.28 v24.81,5.28
D+  (via drill 0.3)
  Top 0.152: v36.24,4 36.47,3.78 36.47,3.7 36.78,3.39 37.22,3.39 37.97,4.13 37.97,4.14 42.2,8.37 42.2,10.95 43.07,11.82 44.18,11.82 44.85,11.15 J1.3
  Bottom 0.152: v36.24,4 36.47,3.78 36.47,3.7 36.78,3.39 37.22,3.39 37.9,4.07 IC2.7
D-  (via drill 0.3)
  Top 0.152: J1.2 45.07,10.5 44.05,11.52 43.2,11.52 42.5,10.82 42.5,7.92 v38.5,3.92
  Bottom 0.152: IC2.6 38.4,4.02 v38.5,3.92
FLASH_MISO  (via drill 0.35)
  Top 0.152: v31.2,8.06 29.92,8.06 R4.1
  Bottom 0.152: IC2.15 32.9,7.11 32.05,7.97 31.42,7.97 v31.2,8.06 31.7,8.44 31.7,8.82 31.86,8.97 31.86,11.57 31.45,11.97 U3.2
FLASH_MOSI  (via drill 0.35)
  Top 0.152: v26.01,8.11 v26.01,8.1 26.01,7.31 27.04,6.28 R3.1 27.54,6.36 28.77,7.59 28.77,7.87 29.68,8.78 31.53,8.78 31.82,8.48 v31.82,7.41
  Bottom 0.152: IC2.14 32.96,6.61 32.16,7.41 v31.82,7.41 | v26.01,8.11 26.01,8.95 25.5,9.46 24.25,9.46 U3.5
GND  (via drill 0.3, 0.35)
  Top 0.152: 5.6,8.02 C6.2 5.7,9.92 5.7,10.12 7.9,12.32 U1.1 | C20.2 15.5,17.62 | v14.1,17.22 15.2,17.22 | 5.6,8.02 5.3,8.02 J6.1 | 5.6,8.02 C1.2 | 15.2,17.22 15,17.62 14.03,18.59 14.03,19.42 13.93,19.52 13.93,20.48 14.62,21.17 21.11,21.17 v21.47,20.81 | 15.2,17.22 C20.2 | C8.2 15.4,16.32 15.2,16.52 15.2,17.22 | 15.2,17.22 15.2,17.61 C20.2 | v18.7,13.52 21.07,11.15 U4.49 23.46,8.69 v23.46,8.61 | IC1.2 46.29,5.32 | v9.38,6.21 11.06,4.54 C4.2 11.48,4.62 12.45,3.65 15.99,3.65 v16.42,3.22 | v23.89,3.25 23.34,3.25 22.27,4.32 D2.C | v43.78,3.29 44.48,4 44.58,4 45.97,5.39 46.24,5.39 | v44.13,12.52 44.23,12.42 44.26,12.45 J1.5
  Top 0.154: 46.24,5.39 IC1.2
  Top 0.305: J1.P$2 J1.5 | J1.P@4 J1.P@3 | J1.P@2 48.49,8.25 | J1.P@1 arc90 47.84,8.65 J1.P$5
  Top 0.813: 48.49,13.74 J1.P@3 J1.P@2 48.49,8.56 | J1.P@1 48.98,7.51 v48.98,6.54 | J1.P@4 v48.49,16.11 v48.48,16.12
  Bottom 0.152: 3.85,8.47 3.9,8.42 3.9,6.62 J6.1 | 3.85,8.47 2,10.32 2,12.42 U2.1 | v14.1,17.22 14.1,15.82 11.7,13.42 11.7,10.72 9.5,8.52 9.38,8.52 | 9.38,8.52 3.9,8.52 3.85,8.47 | 37.9,16.82 36.4,16.82 C3.2 36.3,16.82 36.3,16.52 35,15.22 35,14.92 R12.1 35.04,14.54 34.92,14.42 34.92,13.24 33.46,11.78 33.47,11.77 33.47,11.3 33.66,11.11 IC2.23 | 37.9,16.82 38.8,16.82 C11.2 | 37.9,16.82 37.9,19.92 JP5.2 37.9,20.02 36.7,21.22 21.8,21.22 21.7,21.12 v21.47,20.81 | 40.4,12.72 IC2.35 40.5,12.72 40.9,12.72 | IC2.47 42.1,6.52 42.1,6.12 IC2.48 42.82,6.11 43.08,6.37 | 42.1,6.62 IC2.47 | IC2.23 34.3,11.02 34.3,10.62 IC2.22 35.69,10.61 35.78,10.52 36.5,10.52 38.1,8.92 IC2.THERMAL | 34.3,11.12 IC2.23 | 39.4,6.62 39.4,7.62 38.2,8.82 IC2.THERMAL | 39.4,6.62 39.4,5.02 IC2.4 | 39.4,6.62 42,6.62 IC2.47 | 39.4,6.62 IC2.THERMAL | 40.9,9.02 38.1,9.02 IC2.THERMAL | 40.9,9.02 42,9.02 IC2.42 42.1,9.12 42.1,9.52 IC2.41 42.1,9.62 43.44,9.62 44.45,10.63 44.45,12.2 v44.13,12.52 | 40.9,9.02 40.9,12.72 | 40.9,12.72 IC2.36 | 40.9,9.02 IC2.THERMAL | IC2.THERMAL 38.9,7.42 37,5.52 37,5.02 IC2.9 IC2.10 IC2.11 35.9,4.92 35.87,4.89 35.87,4.39 35.37,3.89 33.52,3.89 33.04,4.37 C7.2 | v9.38,6.21 9.38,8.52 | 31.64,4.37 C7.2 | 30.21,9.41 U3.4 28.82,9.44 28.34,8.96 28.34,6.53 30.5,4.37 C7.2 | 21.81,12.59 C5.2 | v16.42,3.22 16.42,1.77 17.62,0.57 22.81,0.57 24.08,1.84 24.08,3.06 v23.89,3.25
  Bottom 0.154: 43.08,6.37 R6.2 43.99,5.97 Q1.2 44.09,4.19 | 44.09,4.19 44.31,2.91 45.61,2.19 | v43.78,3.29 44.09,3.6 44.09,4.19
  Bottom 0.254: C9.2 21.78,12.62 21.81,12.59
  Bottom 0.305: J1.P$5 45.79,9.47 45.77,9.48 46.12,9.83 46.12,12.55 45.79,12.88 J1.P$2 45.79,14.88 45.52,15.15
  Bottom 0.813: J1.P$5 45.79,7.86 45.55,7.62 | v48.48,16.12 v48.49,16.11 J1.P$4 J1.P$3 48.98,7.16 v48.98,6.54
  other vias: 18.68,10.76 18.68,8.7 21.22,8.76 44.67,14.78
  pour Bottom (isolate 0.254): 0.04,22.07 50,22.07 50,0.11 0,0.11 0,22.02
ICE_MISO
  Top 0.152: R3.2 26.82,8.08 26.24,8.66 25.36,8.66 25.2,8.83 U4.14
ICE_MOSI  (via drill 0.35)
  Top 0.152: v33.26,12.41 33.26,12.34 32.23,11.31 32.23,9.78 33.06,8.95 33.06,6.86 32.35,6.14 R4.2 | U4.17 25.68,10.33 v25.9,10.11
  Bottom 0.152: v33.26,12.41 32.98,12.16 32.98,13.17 32.99,13.6 32.77,13.82 28.87,13.82 28.86,13.81 28.85,13.82 28.3,13.82 27.85,13.38 27.84,13.38 25.86,11.4 v25.9,10.11
ICE_SCK  (via drill 0.35)
  Top 0.152: 24.5,9.32 U4.15 25.36,9.33 25.72,8.97 29.18,8.97 32.41,12.21 32.41,12.9 32,13.31 R16.1 33.31,13.71 33.44,13.84 | v33.37,6.06 33.37,9.38 32.54,10.21 32.54,11.05 32.55,11.05 32.85,11.35 33.71,11.35 33.85,11.49 33.85,12.85 33.44,13.26 33.44,13.84 | 33.44,13.84 v33.44,13.94
  Bottom 0.152: IC2.13 33.43,6.11 v33.37,6.06 | v33.44,13.94 33.09,13.94 32.9,14.13 28.17,14.13 27.72,13.68 27.71,13.68 25.43,11.4 25.11,11.4 24.42,10.71 U3.6
ICE_SS  (via drill 0.35)
  Top 0.152: 27.69,9.71 R5.2 | 27.67,9.75 27.6,9.82 27.35,9.57 | 27.67,9.75 R5.2 | 27.55,9.63 27.67,9.75 | U4.16 25.39,9.83 25.69,9.53 v26.6,9.53 26.79,9.72 R5.2 | v26.34,6.04 26.83,5.55 28.65,5.55 28.94,5.84 28.94,6.65 29.28,6.99 30.85,6.99 31.02,6.82 32.02,6.82 32.43,7.23 v32.43,8.66
  Bottom 0.152: IC2.17 33.59,8.11 33.04,8.66 v32.43,8.66 | v26.6,9.53 26.6,6.3 v26.34,6.04
IOB_0A  (via drill 0.3)
  Top 0.152: U4.46 14.99,9.33 v14.83,9.49
  Bottom 0.152: JP6.15 5,2.22 6.2,3.42 7.7,3.42 13.97,9.11 14.36,9.49 v14.83,9.49
IOB_2A  (via drill 0.3)
  Top 0.152: U4.47 15.03,8.83 v14.84,8.64
  Bottom 0.152: 7.5,2.22 JP6.14 7.5,2.24 7.5,2.32 8.3,3.12 8.6,3.12 14.12,8.64 v14.84,8.64
IOB_3B_G6  (via drill 0.3)
  Top 0.152: v16.8,10.32 17.6,10.32 U4.44
  Bottom 0.152: v16.8,10.32 16.8,9.02 19.5,6.32 19.5,2.82 20.1,2.22 JP6.9
IOB_4A  (via drill 0.3)
  Top 0.152: U4.48 16,8.33 v15.94,8.27
  Bottom 0.152: JP6.12 12.6,2.22 16.31,5.93 16.31,7.7 15.94,8.07 v15.94,8.27
IOB_5B  (via drill 0.3)
  Top 0.152: v15.6,10.02 15.61,10 15.83,9.79 17.02,9.79 17.06,9.83 U4.45
  Bottom 0.152: JP6.13 10.1,2.22 10.1,3.62 12.8,6.32 13.6,6.32 15.41,8.13 15.41,8.49 15.6,8.68 v15.6,10.02
IOB_6A  (via drill 0.3)
  Top 0.152: v15,6.32 17.8,6.32 18.8,7.32 18.8,7.62 U4.2
  Bottom 0.152: v15,6.32 11.2,2.52 11.2,1.72 10.5,1.02 3.6,1.02 JP6.16
IOB_8A  (via drill 0.3)
  Top 0.152: v18.9,5.72 18.9,6.02 19.8,6.92 19.8,7.62 U4.4
  Bottom 0.152: v18.9,5.72 18.9,3.42 17.7,2.22 JP6.10
IOB_9B  (via drill 0.3)
  Top 0.152: U4.3 19.3,7.62 19.3,6.92 18.02,5.64 v16.77,5.64
  Bottom 0.152: v16.77,5.64 15.29,4.15 15.26,4.15 14.95,3.84 14.95,3.4 15.1,3.25 JP6.11
IOB_13B
  Top 0.152: JP6.8 22.45,2.22 21.47,3.3 21.19,3.58 21.19,5.31 21.02,5.49 21.02,6.39 20.82,6.59 U4.6
IOB_16A
  Top 0.152: 25.9,5.02 25.4,5.47 25.05,5.81 24.59,5.81 24.54,5.76 22.69,5.76 22.59,5.86 22.59,6.53 22.32,6.8 U4.9
  Top 0.175: JP6.7 25.9,2.86 25.9,5.02
IOB_18A
  Top 0.152: U4.10 22.82,6.83 22.98,6.67 22.98,6.28 23.16,6.1 24.38,6.1 TP3.1
IOB_20A  (via drill 0.3)
  Top 0.152: v23.65,6.67 23.64,6.69 23.32,7.01 U4.11
  Bottom 0.152: JP6.6 27.8,3.34 27.34,3.8 24.63,3.8 23.65,4.78 v23.65,6.67
IOB_22A  (via drill 0.35)
  Top 0.152: U4.12 23.86,7.64 v24.69,7.64
  Bottom 0.152: JP6.1 39.03,0.75 27.62,0.75 27.32,1.05 26.63,1.74 26.63,2.61 25.79,3.45 24.55,3.45 23.12,4.88 23.12,7.56 23.23,7.67 24.66,7.67 v24.69,7.64
IOB_23B  (via drill 0.3)
  Top 0.152: v25.87,12.95 v25.86,12.95 25.25,12.33 U4.21 | 37.9,2.22 JP6.2 37.1,3.08 36.41,3.08 36.02,3.47 35.59,3.47 34.27,4.8 34.27,5.25 34.55,5.53 34.55,10.03 34.52,10.07 34.52,11.18 34.2,11.5 34.2,11.96 v34.2,13.25 v34.19,13.26
  Bottom 0.152: 34.19,12.94 v34.19,13.26 34.19,15.01 33.54,15.66 27.94,15.66 25.87,13.59 v25.87,12.95
IOB_24A  (via drill 0.35)
  Top 0.152: U4.13 24.97,8.33 25.65,7.65 25.65,5.94 26.55,5.05 27.39,5.05 28.25,4.19 v28.25,3.83
  Bottom 0.152: v28.25,3.83 29.17,2.91 29.17,1.74 29.67,1.23 29.86,1.05 33.36,1.05 33.45,1.13 34.51,1.13 35.42,2.04 JP6.3
IOB_25B_G3
  Top 0.152: TP4.1 26.87,12.6 26.1,11.83 U4.20
IOB_29B  (via drill 0.35)
  Top 0.152: U4.19 26.51,11.33 v26.58,11.3
  Bottom 0.152: JP6.4 32.88,2.25 31.68,3.45 30.96,3.45 27.95,6.46 27.95,10.49 27.14,11.3 v26.58,11.3
IOB_31B  (via drill 0.3)
  Top 0.152: U4.18 25.57,10.83 25.65,10.74 26.41,10.74 v26.69,10.46
  Bottom 0.152: JP6.5 30.3,2.22 30.3,3.42 27.35,6.37 27.35,9.8 v26.69,10.46
IOT_36B
  Top 0.152: JP5.4 31.2,18.32 27.12,18.32 23.82,15.02 U4.25
IOT_37A
  Top 0.152: JP5.3 35.4,19.92 34.7,19.92 32.8,18.02 27.25,18.02 25.37,16.14 25.37,13.68 25.02,13.33 U4.23
IOT_38B
  Top 0.152: JP5.6 27.8,19.92 22.82,14.94 U4.27
IOT_39A
  Top 0.152: JP5.5 30.3,19.92 29.01,18.63 27,18.63 23.32,14.95 U4.26
IOT_41A
  Top 0.152: U4.28 22.32,14.87 24.1,16.65 24.09,16.66 24.09,20.33 23.93,20.49 23.88,20.49 23.03,21.34 21.45,21.34 21.32,21.47 4.76,21.47 3.29,20 JP5.16
IOT_42B  (via drill 0.35)
  Top 0.152: v22.27,16.67 22.02,16.92 22.01,16.91 21.23,16.91 20.82,16.5 U4.31
  Bottom 0.152: JP5.9 20.25,19.93 20.25,18.64 v22.27,16.67
IOT_43A  (via drill 0.3)
  Top 0.152: v21.85,18.65 21.13,18.65 20.8,18.32 20.8,17.14 20.32,16.66 U4.32
  Bottom 0.152: v21.85,18.65 23.91,18.65 JP5.7
IOT_44B  (via drill 0.3)
  Top 0.152: U4.34 19.32,14.9 18.69,15.55 16.19,15.55 16,15.72 14.7,15.72 13.2,17.22 13.2,18.02 v13,18.22
  Bottom 0.152: v13,18.22 13,18.42 13.52,18.42 JP5.11
IOT_45A_G1  (via drill 0.3)
  Top 0.152: v16.45,13.89 17.6,13.92 U4.37
  Bottom 0.152: JP5.10 17.6,19.92 17.6,15.82 16.5,14.72 16.5,14.71 16.45,14.66 v16.45,13.89
IOT_46B_G0  (via drill 0.3)
  Top 0.152: v15.7,15.12 18.6,15.12 18.8,14.92 18.8,14.52 U4.35 | JP5.8 22.7,19.92 21.9,19.92 20.7,18.72 16.6,18.72 v16.5,18.62
  Bottom 0.152: v16.5,18.62 16.4,18.52 16.4,15.82 v15.7,15.12
IOT_48B
  Top 0.152: U4.36 18.3,14.52 15.4,14.52 10,19.92 JP5.13
IOT_49A  (via drill 0.3)
  Top 0.152: v13.5,10.52 13.8,10.52 14.2,10.92 17.6,10.92 U4.43
  Bottom 0.152: v13.5,10.52 13.8,10.52 14.82,11.54 14.82,13.43 16.13,14.73 16.13,14.77 16.2,14.84 16.2,14.92 17.1,15.82 17.1,18.82 16.3,19.62 16.3,20.52 15.6,21.22 13.8,21.22 12.6,20.02 JP5.12
IOT_50B
  Top 0.152: U4.38 17.6,13.32 14.92,13.32 14.65,13.59 14.65,14.67 10.5,18.82 9.5,18.82 8.7,19.62 8.7,20.4 8.65,20.45 8.65,20.48 7.96,21.17 6.11,21.17 JP5.15
IOT_51A  (via drill 0.3)
  Top 0.152: v13.8,11.32 17.6,11.32 U4.42 | v13.8,14.72 10.1,18.42 9,18.42 7.5,19.92 JP5.14
  Bottom 0.152: v13.8,14.72 v13.8,11.32
LED_BLUE
  Top 0.152: LED.B 14.3,12.92 17.6,12.92 U4.39
LED_GREEN
  Top 0.152: LED.G 10.8,14.72 13.1,12.42 17.6,12.42 U4.40
LED_RED
  Top 0.152: LED.R 12.3,11.92 17.6,11.92 U4.41
N$1  (via drill 0.35)
  Top 0.203: v22.89,17.66 R2.2
  Top 0.254: U4.29 21.82,15.24 v21.82,15.25
  Bottom 0.203: C9.1 20.5,14.34 20.5,15.37 20.74,15.61 21.24,15.61 21.4,15.77 22.37,15.77 22.89,16.29 v22.89,17.66
  Bottom 0.254: C9.1 C5.1 21.84,15.26 v21.82,15.25
N$2
  Bottom 0.154: IC2.1 42.79,4.96 Q1.1
N$3  (via drill 0.3)
  Top 0.152: v24.7,14.52 24.5,14.32 24.5,13.92 U4.24 | v25.9,15.42 26.9,15.42 D1.C
  Bottom 0.152: v24.7,14.52 25,14.52 v25.9,15.42
N$4
  Bottom 0.152: R13.1 29.24,17.53 27.66,15.95 25.16,15.95 22.9,13.69 22.9,12.8 23.73,11.97 U3.7
N$6  (via drill 0.35)
  Top 0.152: R14.1 v28.44,12.67 v28.43,12.66
  Bottom 0.152: U3.3 29.57,10.71 28.9,11.37 28.9,12.19 28.49,12.6 v28.43,12.66
N$7  (via drill 0.35)
  Top 0.152: R5.1 29.02,11.52 30.19,12.69 30.19,12.75 | 30.19,12.75 30.19,13.62 R15.1 | v31.78,12.55 30.39,12.55 30.19,12.75
  Bottom 0.152: U3.1 31.09,13.24 v31.78,12.55
N$9  (via drill 0.35)
  Bottom 0.152: R6.1 45.96,5.54 45.96,5.18 47.27,3.87 47.27,1.31 46.74,0.78 42.19,0.78 41.77,1.2 41.77,3.05 41.42,3.41 39.22,3.41 v39.15,3.34 39.15,4.17 38.9,4.42 IC2.5
N$10
  Top 0.152: R9.2 39.1,10.82 37.5,10.82 LED2.A
N$11
  Top 0.152: R8.2 39.1,8.52 37.4,8.52 LED1.A
N$12  (via drill 0.3)
  Top 0.152: 46.49,6.58 IC1.3 44.75,8 v44.75,8.68
  Bottom 0.152: IC2.43 42.7,8.62 42.9,8.82 44.61,8.82 v44.75,8.68 44.86,8.79 44.86,9.61 45.56,10.31 45.56,12.38 42.48,15.46 R10.1
N$13  (via drill 0.3)
  Top 0.152: IC1.5 44.21,5.47 44.84,6.1 44.84,7.09
  Top 0.154: v44.49,7.44 44.84,7.09
  Bottom 0.152: 42.1,7.52 IC2.45 | 43.5,7.61 44.32,7.61 v44.49,7.44
  Bottom 0.154: IC2.45 43.5,7.61
N$14  (via drill 0.3)
  Top 0.154: IC1.4 44.03,6.93 43.87,7.1 43.87,7.99 v43.63,8.22
  Bottom 0.154: IC2.44 43.63,8.11 v43.63,8.22
N$15  (via drill 0.3)
  Top 0.152: IC1.1 47.1,4.52 v47.4,4.82
  Bottom 0.152: R10.2 45.8,16.2 46.67,15.33 46.67,7.13 46.91,6.89 46.91,5.31 v47.4,4.82
N$16
  Top 0.152: U4.7 21.32,5.63 21.36,5.58
  Top 0.175: 21.36,5.58 21.87,5.08 22.92,5.08 D2.A R17.1
OSC_OUT  (via drill 0.3)
  Top 0.152: J8.1 43.58,2.76 44,2.76 44.89,3.65 v46.74,3.65
  Bottom 0.152: IC2.2 40.4,4.56 40.73,4.23 41.03,4.23 42.42,2.83
  Bottom 0.154: 45.19,4.38 Q1.3 45.19,3.97 v46.74,3.65 | 42.42,2.83 J8.1
VCC  (via drill 0.3)
  Top 0.152: 19.5,5.32 19.5,6.12 20.3,6.92 20.3,7.62 U4.5 | 19.5,5.32 19.1,4.72 R1.2 | 19.5,5.32 v20.1,5.92 | 19.5,5.32 R1.2 | C4.1 15.37,4.62 16.04,3.95 18.32,3.95 R1.2 | U4.30 21.32,14.96 21.26,15.02 21.26,15.48 21.47,15.69 21.47,16.36 v21.45,16.38
  Bottom 0.152: v20.1,5.92 20.1,6.21 | 20.1,6.21 20.1,6.22 17.33,8.99 17.33,14.03 18.27,14.96 18.21,15.02 18.21,16.59 18.47,16.85 20.98,16.85 v21.45,16.38 | 20.05,6.21 20.1,6.21
VCCA  (via drill 0.3)
  Top 0.152: v34.9,15.92 38.4,15.92 39,16.52 41.8,16.52 42,16.32 v42,12.32
  Bottom 0.152: v42,12.32 42,11.62 IC2.37 | v34.9,15.92 34.9,16.62 34.7,16.82 C3.1
VCCIO2  (via drill 0.3)
  Top 0.152: v13,5.62 12.1,6.52 J2.2 12.2,6.52 | U4.1 15.98,7.68 v15.78,7.48
  Bottom 0.152: v15.78,7.48 15.58,7.48 14.95,6.85 14.78,6.85 13.55,5.62 v13,5.62
VCCIO3  (via drill 0.3)
  Top 0.152: 19.7,16.02 19.8,15.92 19.8,14.52 U4.33 | v12.2,8.92 12.2,7.92 J5.2 | 19.7,16.02 v18.8,17.52 | 19.7,16.02 C8.1
  Bottom 0.152: v12.2,8.92 12.7,8.92 15.04,11.26 15.07,11.26 17.03,13.21 17.03,14.15 17.91,15.03 17.91,16.82 18.6,17.52 v18.8,17.52

### Text on the board
tPlace: 28 | 38 | 42 | 35 | 43 | 34 | 37 | 31 | 35 | 32 | 27 | 26 | 25 | 23 | GND | 3.3V | UPDuino v2.1 | 3.3V | 1.2V | 5V | GND | VCC IO SELECT | 18 | 19 | 13 | 2 | 46 | 47 | 45 | 48 | 3 | 4 | 44 | 6 | 9 | 11 | 21 | 12
bNames: 1